# EAGLE design schematic (EAGLE 9.2.0)
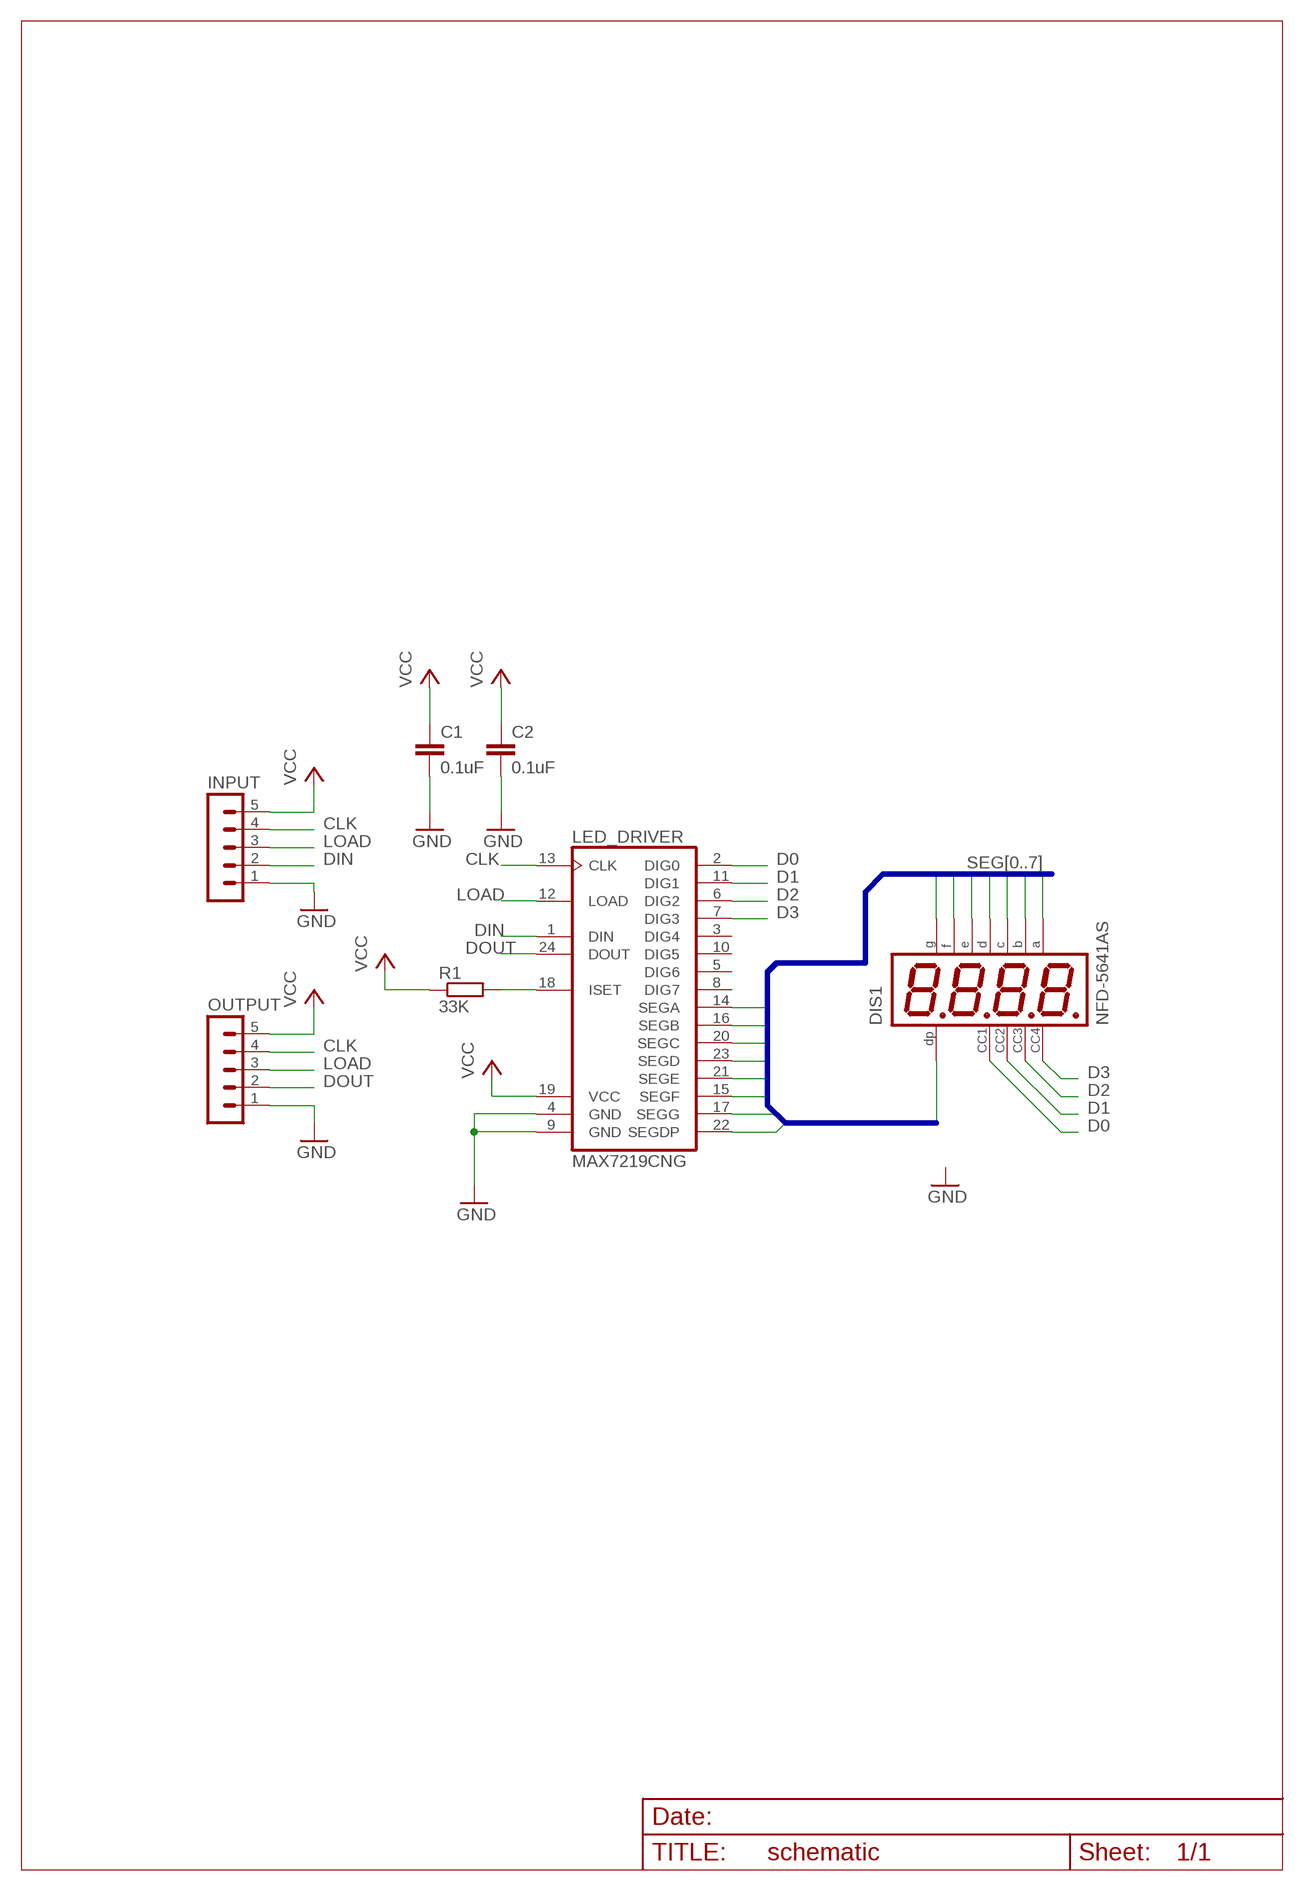
[diagram p0: schematic, sheet 1]

## Parts
C1  0.1uF  C-EU025-025X050  [C025-025X050]
C2  0.1uF  C-EU025-025X050  [C025-025X050]
DIS1  NFD-5641AS  [NFD-5641]
INPUT  MA05-1  [MA05-1]
LED_DRIVER  MAX7219CNG  [DIL24-3]
OUTPUT  MA05-1  [MA05-1]
R1  33K  R-EU_0207/10  [0207/10]

## Nets
CLK: INPUT.4 LED_DRIVER.13(CLK) OUTPUT.4
D0: DIS1.P$12 LED_DRIVER.2(DIG0)
D1: DIS1.P$9 LED_DRIVER.11(DIG1)
D2: DIS1.P$8 LED_DRIVER.6(DIG2)
D3: DIS1.P$6 LED_DRIVER.7(DIG3)
DIN: INPUT.2 LED_DRIVER.1(DIN)
DOUT: LED_DRIVER.24(DOUT) OUTPUT.2
GND: C1.2 C2.2 INPUT.1 LED_DRIVER.4(GND) LED_DRIVER.9(GND) OUTPUT.1
LOAD: INPUT.3 LED_DRIVER.12(LOAD) OUTPUT.3
N$1: LED_DRIVER.18(ISET) R1.2
SEG0: DIS1.P$11 LED_DRIVER.14(SEGA)
SEG1: DIS1.P$7 LED_DRIVER.16(SEGB)
SEG2: DIS1.P$4 LED_DRIVER.20(SEGC)
SEG3: DIS1.P$2 LED_DRIVER.23(SEGD)
SEG4: DIS1.P$1 LED_DRIVER.21(SEGE)
SEG5: DIS1.P$10 LED_DRIVER.15(SEGF)
SEG6: DIS1.P$5 LED_DRIVER.17(SEGG)
SEG7: DIS1.P$3 LED_DRIVER.22(SEGDP)
VCC: C1.1 C2.1 INPUT.5 LED_DRIVER.19(VCC) OUTPUT.5 R1.1
Unconnected: LED_DRIVER.3(DIG4) LED_DRIVER.5(DIG6) LED_DRIVER.8(DIG7) LED_DRIVER.10(DIG5)

## Buses
SEG[0..7]

## Library data of the parts
C1 C2 = rcl:C-EU: CAPACITOR, European symbol; SPICEPREFIX: C
DIS1 = display-nfd:NFD-5641AS: Four Digit 0.56" CC Seven-Segment LED Display Futurlec part number: 7FR5641AS Created by RobG
INPUT OUTPUT = con-lstb:MA05-1: PIN HEADER; OC_FARNELL: unknown; OC_NEWARK: unknown
LED_DRIVER = maxim:MAX7219CNG: LED DISPLAY DRIVER; MF: MAXIM; MPN: MAX7219CNG; OC_FARNELL: 1523914; OC_NEWARK: 34C4018
R1 = rcl:R-EU_: RESISTOR, European symbol; SPICEPREFIX: R

## Board
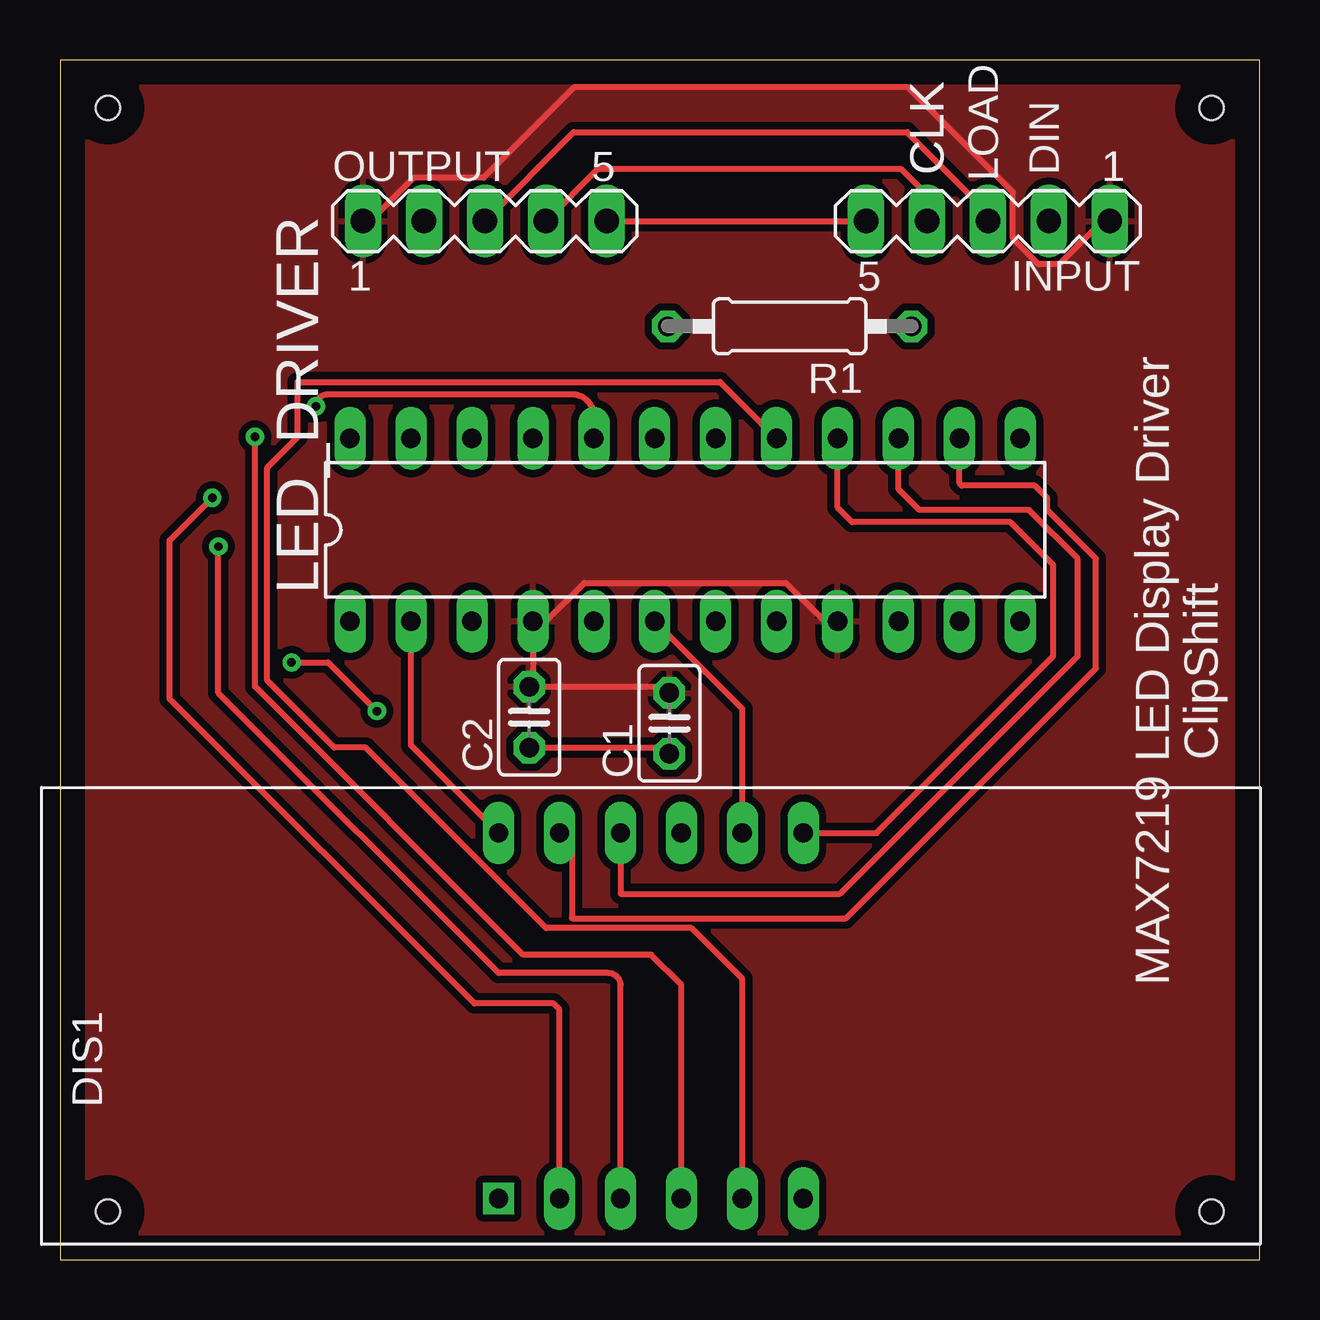
[diagram p1: board, top side]
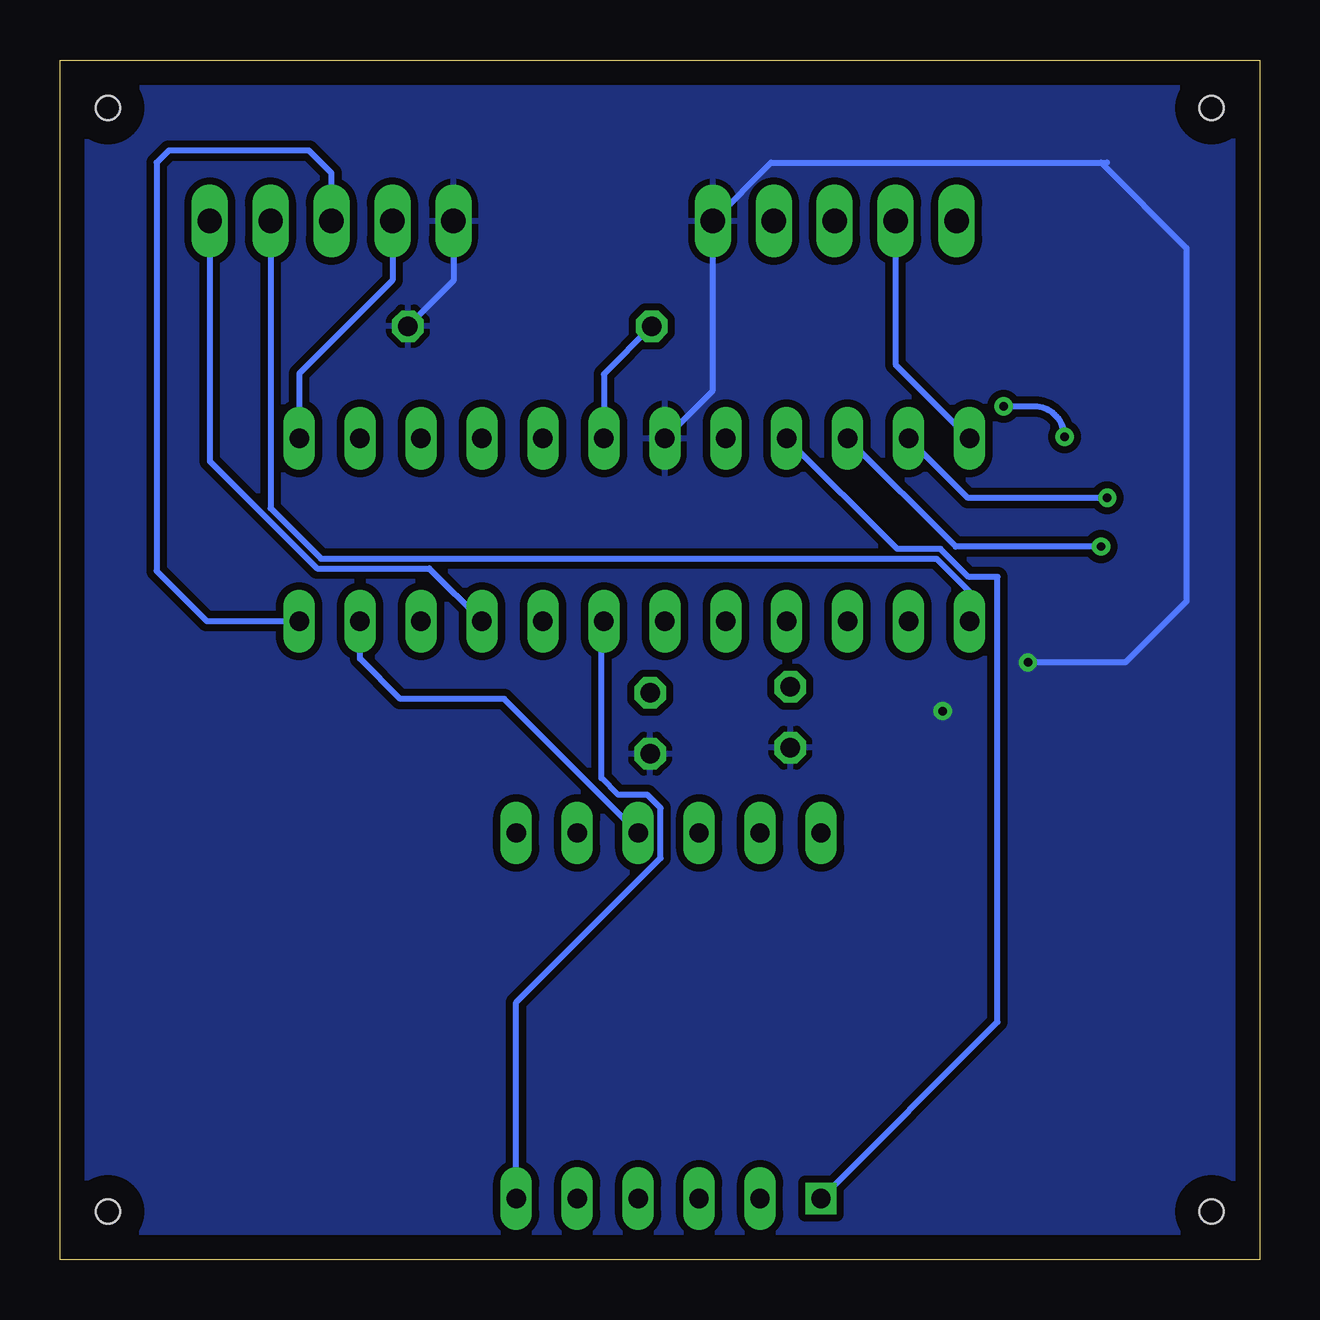
[diagram p2: board, bottom side, seen from below]

Size 50 x 50 mm. Coordinates in mm from the lower left corner, seen from the top.
Outline: 0,0 50,0 50,50 0,50 0,0
Copper layers (1*16): Top 0.035mm / dielectric 1.5mm / Bottom 0.035mm
Design rules "default": minimum track width 6mil, minimum drill 0.35mm, track to track 6mil, track to pad 6mil, pad to pad 6mil, via to via 6mil, smd to smd 6mil, copper to edge 40mil, drill to drill 6mil, minimum pad ring 10mil, minimum via ring 8mil, stop-mask expansion 4mil, vias tented up to drill 0mil, thermal gap 10mil
Holes 1 mm at 48,2 2,2 2,48 48,48

### Footprints (pad centres in the part's own frame; a part is rotated, then mirrored left to right if it is on the bottom)
C025-025X050 = drill 0.813 octagon: 1 -1.27,0; 2 1.27,0
NFD-5641 = drill 0.8 square: P$1 -6.35,-7.62 | drill 0.8 long: P$2 -3.81,-7.62; P$3 -1.27,-7.62; P$4 1.27,-7.62; P$5 3.81,-7.62; P$6 6.35,-7.62; P$7 6.35,7.62; P$8 3.81,7.62; P$9 1.27,7.62; P$10 -1.27,7.62; P$11 -3.81,7.62; P$12 -6.35,7.62
MA05-1 = drill 1.016 long: 1 -5.08,0; 2 -2.54,0; 3 0,0; 4 2.54,0; 5 5.08,0
DIL24-3 = drill 0.813 long: 1 -13.97,-3.81; 2 -11.43,-3.81; 3 -8.89,-3.81; 4 -6.35,-3.81; 5 -3.81,-3.81; 6 -1.27,-3.81; 7 1.27,-3.81; 8 3.81,-3.81; 9 6.35,-3.81; 10 8.89,-3.81; 11 11.43,-3.81; 12 13.97,-3.81; 13 13.97,3.81; 14 11.43,3.81; 15 8.89,3.81; 16 6.35,3.81; 17 3.81,3.81; 18 1.27,3.81; 19 -1.27,3.81; 20 -3.81,3.81; 21 -6.35,3.81; 22 -8.89,3.81; 23 -11.43,3.81; 24 -13.97,3.81
0207/10 = drill 0.813 octagon: 1 -5.08,0; 2 5.08,0

### Placement (x,y rotation side)
C1  25.4,22.35 90 top
C2  19.56,22.61 90 top
DIS1  24.63,10.16 0 top
INPUT  38.68,43.29 180 top
LED_DRIVER  26.06,30.42 0 top
OUTPUT  17.71,43.29 0 top
R1  30.41,38.9 180 top

### Tracks (layer width: path | path; a pad name or v marks a point on that pad's centre or on a via)
CLK
  Top 0.254: OUTPUT.4 22.43,45.47 35.05,45.47 36.14,44.38 INPUT.4
  Bottom 0.254: INPUT.4 36.14,40.82 40.03,36.93 LED_DRIVER.13
D0
  Top 0.254: DIS1.P$12 14.63,21.43 LED_DRIVER.2
D1
  Bottom 0.254: DIS1.P$9 31.49,23.37 35.81,23.37 37.49,25.04 LED_DRIVER.11
D2
  Top 0.254: DIS1.P$8 28.44,22.96 LED_DRIVER.6
D3
  Bottom 0.254: DIS1.P$6 30.98,10.73 24.97,16.74 24.97,18.82 25.51,19.37 26.73,19.37 27.43,20.07 27.43,26.5 LED_DRIVER.7
DIN
  Bottom 0.254: INPUT.2 41.22,31.31 39.12,29.21 13.46,29.21 12.09,27.84 LED_DRIVER.1
DOUT
  Bottom 0.254: OUTPUT.2 15.17,37.31 LED_DRIVER.24
GND
  Top 0.254: INPUT.1 43.45,43.29 41.65,41.49 40.79,41.49 39.72,42.55 39.72,44.48 35.35,48.86 21.43,48.86 17.66,45.09 14.74,45.09 12.94,43.29 OUTPUT.1 | C1.2 25.15,23.88 C2.2 19.71,24.03 LED_DRIVER.4 20.26,26.61 21.86,28.21 30.26,28.21 31.86,26.61 LED_DRIVER.9
  Bottom 0.254: LED_DRIVER.9 34.61,28.8 39.28,28.8 43.76,33.28 INPUT.1
  pour Top (isolate 0.305): 0,50.04 50.04,50.04 50.04,0 0,0
  pour Top (isolate 0.305): 0.25,0.25 49.78,0.25 49.78,49.78 0.25,49.78
LOAD
  Top 0.254: OUTPUT.3 21.41,46.99 35.31,46.99 | 35.31,46.99 38.68,43.62 | 38.68,43.62 INPUT.3 | 35.31,46.99 38.68,43.62
  Bottom 0.254: INPUT.3 38.68,45.28 39.62,46.23 45.47,46.23 45.97,45.72 45.97,28.7 43.88,26.61 LED_DRIVER.12
N$1
  Bottom 0.254: R1.2 27.33,36.9 LED_DRIVER.18
SEG0
  Top 0.254: DIS1.P$11 21.34,17.26 21.34,14.22 32.77,14.22 43.18,24.64 43.18,29.21 41.15,31.24 41.15,31.75 40.64,32.26 37.59,32.26 37.49,32.36 LED_DRIVER.14
SEG1
  Top 0.254: DIS1.P$7 34.04,17.78 41.4,25.15 41.4,28.96 39.62,30.73 33.02,30.73 32.41,31.34 LED_DRIVER.16
SEG2  (via drill 0.35)
  Top 0.254: DIS1.P$4 25.9,11.44 24.64,12.7 19.3,12.7 8.13,23.88 v8.13,34.29 | v10.67,35.56 arc-90 11.18,36.07 21.34,36.07 arc-90 22.25,35.15 LED_DRIVER.20
  Bottom 0.254: v8.13,34.29 arc-90 9.4,35.56 v10.67,35.56
SEG3  (via drill 0.35)
  Top 0.254: DIS1.P$2 20.82,10.42 20.57,10.67 17.27,10.67 4.57,23.37 4.57,29.97 v6.35,31.75
  Bottom 0.254: v6.35,31.75 12.15,31.75 LED_DRIVER.23
SEG4
  Bottom 0.254: DIS1.P$1 10.92,9.9 10.92,28.45 12.12,28.45 13.29,29.62 15.1,29.62 LED_DRIVER.21
SEG5
  Top 0.254: DIS1.P$10 23.37,15.24 32.51,15.24 42.42,25.15 42.42,29.21 40.39,31.24 35.81,31.24 34.95,32.11 LED_DRIVER.15
SEG6
  Top 0.254: DIS1.P$5 28.44,11.69 26.31,13.82 20.27,13.82 12.75,21.34 11.43,21.34 8.64,24.13 8.64,33.02 9.91,34.29 9.91,36.58 27.52,36.58 LED_DRIVER.17
SEG7  (via drill 0.35)
  Top 0.254: DIS1.P$3 arc90 DIS1.P$3 23.37,11.43 arc90 22.86,11.94 18.29,11.94 6.6,23.62 v6.6,29.72
  Bottom 0.254: v6.6,29.72 12.66,29.72 LED_DRIVER.22
VCC  (via drill 0.35)
  Top 0.254: OUTPUT.5 INPUT.5 | C2.1 25.15,21.34 C1.1 | v9.65,24.89 11.18,24.89 v13.21,22.86
  Bottom 0.254: INPUT.5 33.6,40.79 R1.1 | LED_DRIVER.19 22.79,36.23 OUTPUT.5 20.36,45.72 6.6,45.72 | 6.6,45.72 6.35,45.72 | 6.6,45.72 3.05,42.16 3.05,27.43 5.59,24.89 v9.65,24.89
  pour Bottom (isolate 0.305): 0,50.04 50.04,50.04 50.04,0 0,0

### Text on the board
tNames: CLK | CLK | LOAD | DIN | ClipShift | MAX7219 LED Display Driver